# Altium schematic sheet MAIN.SchDoc
size A4
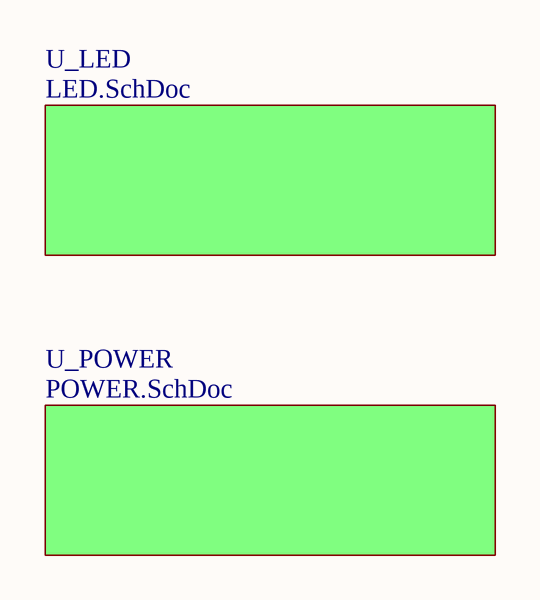
[diagram p0: MAIN.SchDoc]

## Sub-sheets
U_LED = LED.SchDoc: no entries
U_POWER = POWER.SchDoc: no entries